# EAGLE schematic MusselBedHeater_RevG (EAGLE 9.6.1)
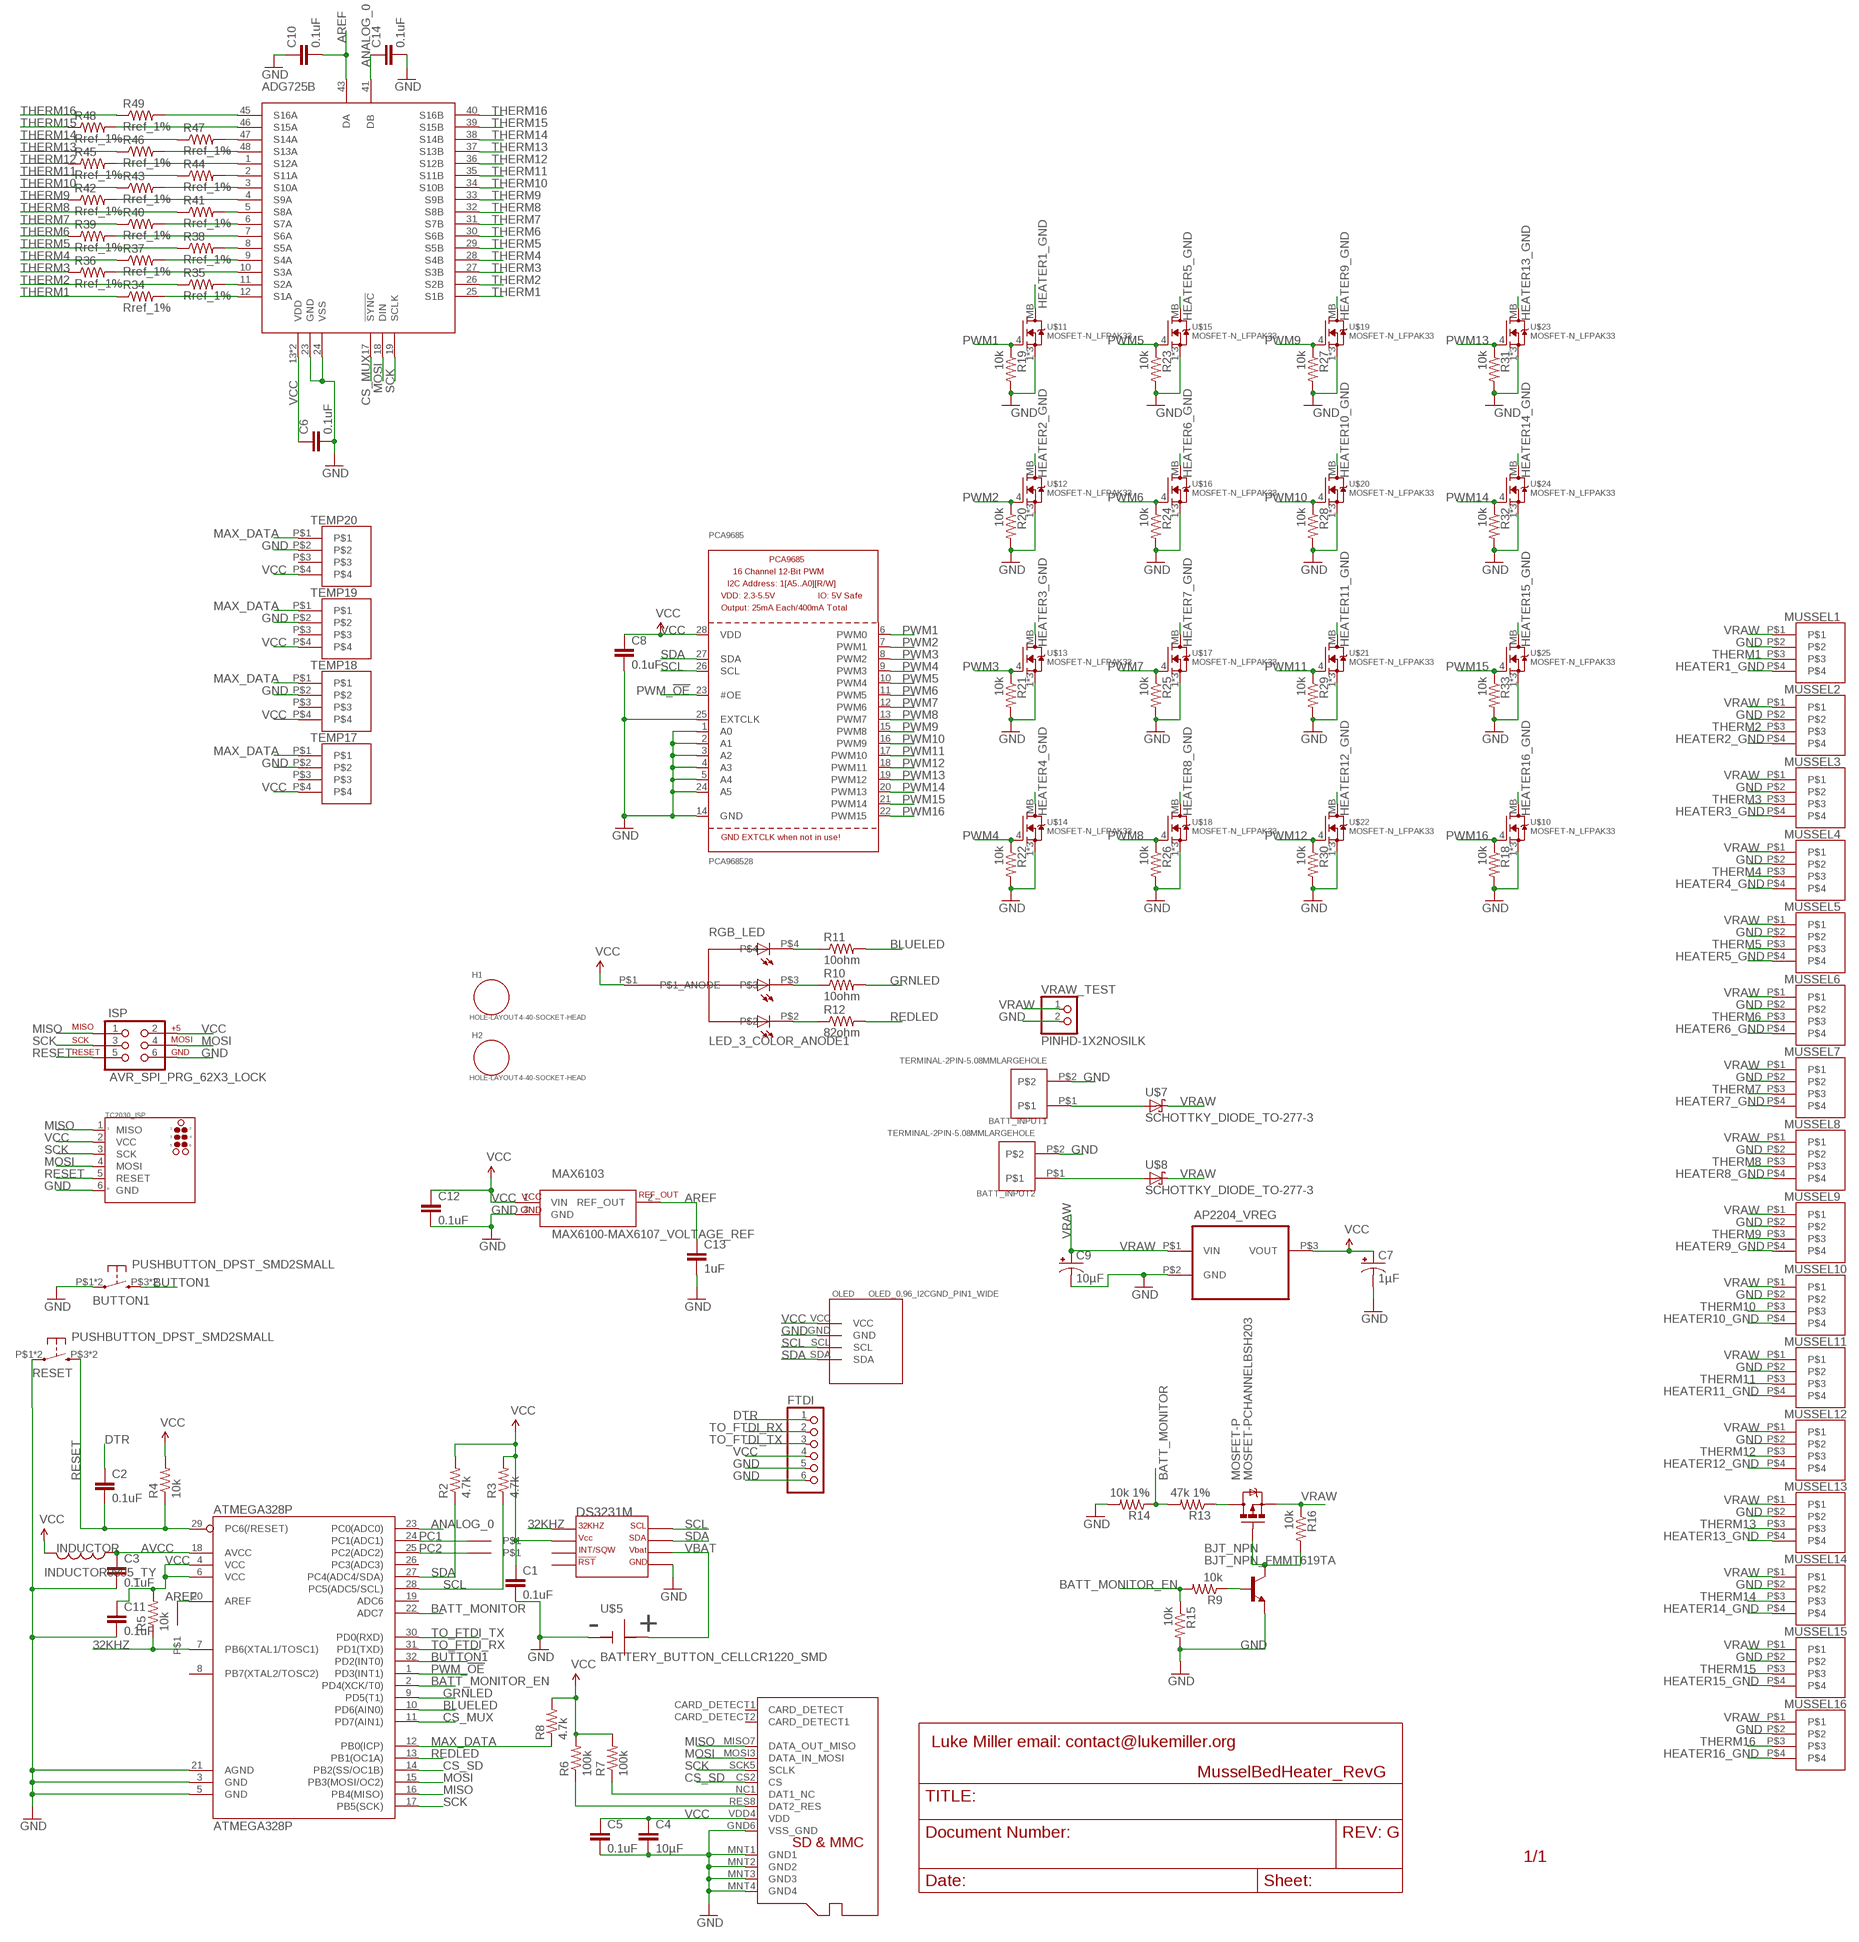
[diagram p0: schematic, sheet 1]

## Parts
ADG725B  ADG725_MUX  [TQFP48]
AP2204_VREG  AP2204R  [SOT-89]
AREF  PINHD-1X1STANDARD  [1X01]
ATMEGA328P  ATMEGA328P  ATMEGA328_SMT  [TQFP32-08]
BATT_INPUT1  TERMINAL-2PIN-5.08MMLARGEHOLE  [TERMINAL-2PIN-5.08MM_LARGEHOLE]
BATT_INPUT2  TERMINAL-2PIN-5.08MMLARGEHOLE  [TERMINAL-2PIN-5.08MM_LARGEHOLE]
BJT_NPN  BJT_NPN_FMMT619TA  [SOT23]
BUTTON1  PUSHBUTTON_DPST_SMD2SMALL  [PUSHBUTTON_SPST_PTS525_SERIES]
C1  0.1uF  CAP0603  [0603]
C2  0.1uF  CAP0603  [0603]
C3  0.1uF  CAP0603  [0603]
C4  10µF  CAP0603  [0603]
C5  0.1uF  CAP0603  [0603]
C6  0.1uF  CAP0603  [0603]
C7  1µF  CPOL-USB  [PANASONIC_B]
C8  0.1uF  CAP0603  [0603]
C9  10µF  CPOL-USC  [PANASONIC_C]
C10  0.1uF  CAP0603  [0603]
C11  0.1uF  CAP0603  [0603]
C12  0.1uF  CAP0603  [0603]
C13  1uF  CAP0603  [0603]
C14  0.1uF  CAP0603  [0603]
DS3231M  DS3231MSOIC-8  [DS3231M_SOIC8]
FTDI  PINHD-1X6RA  [1X06-RIGHT_ANGLE]
H1  HOLE-LAYOUT4-40-SOCKET-HEAD  [4-40-SCREW-HOLE]
H2  HOLE-LAYOUT4-40-SOCKET-HEAD  [4-40-SCREW-HOLE]
INDUCTOR  INDUCTOR0805_TY  [I_0805]
ISP  AVR_SPI_PRG_62X3_LOCK  [2X3_LOCK]
MAX6103  MAX6100-MAX6107_VOLTAGE_REF  [SOT23-3]
MOSFET-P  MOSFET-PCHANNELBSH203  [SOT23-3]
MUSSEL1  MOLEX_KK_254_4_PIN_HEADER  [MOLEX_KK_254_4PIN_HEADER]
MUSSEL2  MOLEX_KK_254_4_PIN_HEADER  [MOLEX_KK_254_4PIN_HEADER]
MUSSEL3  MOLEX_KK_254_4_PIN_HEADER  [MOLEX_KK_254_4PIN_HEADER]
MUSSEL4  MOLEX_KK_254_4_PIN_HEADER  [MOLEX_KK_254_4PIN_HEADER]
MUSSEL5  MOLEX_KK_254_4_PIN_HEADER  [MOLEX_KK_254_4PIN_HEADER]
MUSSEL6  MOLEX_KK_254_4_PIN_HEADER  [MOLEX_KK_254_4PIN_HEADER]
MUSSEL7  MOLEX_KK_254_4_PIN_HEADER  [MOLEX_KK_254_4PIN_HEADER]
MUSSEL8  MOLEX_KK_254_4_PIN_HEADER  [MOLEX_KK_254_4PIN_HEADER]
MUSSEL9  MOLEX_KK_254_4_PIN_HEADER  [MOLEX_KK_254_4PIN_HEADER]
MUSSEL10  MOLEX_KK_254_4_PIN_HEADER  [MOLEX_KK_254_4PIN_HEADER]
MUSSEL11  MOLEX_KK_254_4_PIN_HEADER  [MOLEX_KK_254_4PIN_HEADER]
MUSSEL12  MOLEX_KK_254_4_PIN_HEADER  [MOLEX_KK_254_4PIN_HEADER]
MUSSEL13  MOLEX_KK_254_4_PIN_HEADER  [MOLEX_KK_254_4PIN_HEADER]
MUSSEL14  MOLEX_KK_254_4_PIN_HEADER  [MOLEX_KK_254_4PIN_HEADER]
MUSSEL15  MOLEX_KK_254_4_PIN_HEADER  [MOLEX_KK_254_4PIN_HEADER]
MUSSEL16  MOLEX_KK_254_4_PIN_HEADER  [MOLEX_KK_254_4PIN_HEADER]
OLED  OLED_0.96_I2CGND_PIN1_WIDE  [OLED_0.96_I2C_GND_PIN1_WIDE]
PC1  PINHD-1X1STANDARD  [1X01]
PC2  PINHD-1X1STANDARD  [1X01]
PCA9685  PCA968528  [28-TSSOP]
R2  4.7k  RESISTOR_SMDR0603  [R0603]
R3  4.7k  RESISTOR_SMDR0603  [R0603]
R4  10k  RESISTOR_SMDR0603  [R0603]
R5  10k  RESISTOR_SMDR0603  [R0603]
R6  100k  RESISTOR_SMDR0603  [R0603]
R7  100k  RESISTOR_SMDR0603  [R0603]
R8  4.7k  RESISTOR_SMDR0603  [R0603]
R9  10k  RESISTOR_SMDR0603  [R0603]
R10  10ohm  RESISTOR_SMDR0603  [R0603]
R11  10ohm  RESISTOR_SMDR0603  [R0603]
R12  82ohm  RESISTOR_SMDR0603  [R0603]
R13  47k 1%  RESISTOR_SMDR0603  [R0603]
R14  10k 1%  RESISTOR_SMDR0603  [R0603]
R15  10k  RESISTOR_SMDR0603  [R0603]
R16  10k  RESISTOR_SMDR0603  [R0603]
R18  10k  RESISTOR_SMDR0603  [R0603]
R19  10k  RESISTOR_SMDR0603  [R0603]
R20  10k  RESISTOR_SMDR0603  [R0603]
R21  10k  RESISTOR_SMDR0603  [R0603]
R22  10k  RESISTOR_SMDR0603  [R0603]
R23  10k  RESISTOR_SMDR0603  [R0603]
R24  10k  RESISTOR_SMDR0603  [R0603]
R25  10k  RESISTOR_SMDR0603  [R0603]
R26  10k  RESISTOR_SMDR0603  [R0603]
R27  10k  RESISTOR_SMDR0603  [R0603]
R28  10k  RESISTOR_SMDR0603  [R0603]
R29  10k  RESISTOR_SMDR0603  [R0603]
R30  10k  RESISTOR_SMDR0603  [R0603]
R31  10k  RESISTOR_SMDR0603  [R0603]
R32  10k  RESISTOR_SMDR0603  [R0603]
R33  10k  RESISTOR_SMDR0603  [R0603]
R34  Rref_1%  RESISTOR_SMDR0603  [R0603]
R35  Rref_1%  RESISTOR_SMDR0603  [R0603]
R36  Rref_1%  RESISTOR_SMDR0603  [R0603]
R37  Rref_1%  RESISTOR_SMDR0603  [R0603]
R38  Rref_1%  RESISTOR_SMDR0603  [R0603]
R39  Rref_1%  RESISTOR_SMDR0603  [R0603]
R40  Rref_1%  RESISTOR_SMDR0603  [R0603]
R41  Rref_1%  RESISTOR_SMDR0603  [R0603]
R42  Rref_1%  RESISTOR_SMDR0603  [R0603]
R43  Rref_1%  RESISTOR_SMDR0603  [R0603]
R44  Rref_1%  RESISTOR_SMDR0603  [R0603]
R45  Rref_1%  RESISTOR_SMDR0603  [R0603]
R46  Rref_1%  RESISTOR_SMDR0603  [R0603]
R47  Rref_1%  RESISTOR_SMDR0603  [R0603]
R48  Rref_1%  RESISTOR_SMDR0603  [R0603]
R49  Rref_1%  RESISTOR_SMDR0603  [R0603]
RESET  PUSHBUTTON_DPST_SMD2SMALL  [PUSHBUTTON_SPST_PTS525_SERIES]
RGB_LED  LED_3_COLOR_ANODE1  [LED_RGB_SMD_1.6X1.6]
TC2030_ISP  TC2030-MCP-NL  [TC2030-MCP-NL]
TEMP17  MOLEX_KK_254_4_PIN_HEADER  [MOLEX_KK_254_4PIN_HEADER]
TEMP18  MOLEX_KK_254_4_PIN_HEADER  [MOLEX_KK_254_4PIN_HEADER]
TEMP19  MOLEX_KK_254_4_PIN_HEADER  [MOLEX_KK_254_4PIN_HEADER]
TEMP20  MOLEX_KK_254_4_PIN_HEADER  [MOLEX_KK_254_4PIN_HEADER]
U$2  MICROSD_MOLEX_REVERSECURRENT  [MICROSD_SOCKET_MOLEX_REVERSEMOUNT]
U$5  BATTERY_BUTTON_CELLCR1220_SMD  [CR1220_BATTERY_HOLDER_SMD]
U$7  SCHOTTKY_DIODE_TO-277-3  [TO-277-3]
U$8  SCHOTTKY_DIODE_TO-277-3  [TO-277-3]
U$10  MOSFET-N_LFPAK33  [SOT1210]
U$11  MOSFET-N_LFPAK33  [SOT1210]
U$12  MOSFET-N_LFPAK33  [SOT1210]
U$13  MOSFET-N_LFPAK33  [SOT1210]
U$14  MOSFET-N_LFPAK33  [SOT1210]
U$15  MOSFET-N_LFPAK33  [SOT1210]
U$16  MOSFET-N_LFPAK33  [SOT1210]
U$17  MOSFET-N_LFPAK33  [SOT1210]
U$18  MOSFET-N_LFPAK33  [SOT1210]
U$19  MOSFET-N_LFPAK33  [SOT1210]
U$20  MOSFET-N_LFPAK33  [SOT1210]
U$21  MOSFET-N_LFPAK33  [SOT1210]
U$22  MOSFET-N_LFPAK33  [SOT1210]
U$23  MOSFET-N_LFPAK33  [SOT1210]
U$24  MOSFET-N_LFPAK33  [SOT1210]
U$25  MOSFET-N_LFPAK33  [SOT1210]
VRAW_TEST  PINHD-1X2NOSILK  [1X02_NOSILK]

## Nets
32KHZ: ATMEGA328P.7(PB6(XTAL1/TOSC1)) DS3231M.1(P$1_32KHZ) R5.1
ANALOG_0: ADG725B.41(DB) ATMEGA328P.23(PC0(ADC0)) C14.1
AREF: ADG725B.43(DA) AREF.1 ATMEGA328P.20(AREF) C10.2 C13.1 MAX6103.2(REF_OUT)
AVCC: ATMEGA328P.18(AVCC) C3.1 INDUCTOR.P$1
BATT_MONITOR: ATMEGA328P.22(ADC7) R13.2 R14.1
BATT_MONITOR_EN: ATMEGA328P.2(PD4(XCK/T0)) R9.2 R15.1
BLUELED: ATMEGA328P.10(PD6(AIN0)) R11.2
BUTTON1: ATMEGA328P.32(PD2(INT0)) BUTTON1.P$3(S) BUTTON1.P$4(S)
CS_MUX: ADG725B.17(!SYNC) ATMEGA328P.11(PD7(AIN1))
CS_SD: ATMEGA328P.14(PB2(SS/OC1B)) U$2.CS2(CS)
DTR: C2.1 FTDI.1
GND: ADG725B.23(GND) ADG725B.24(VSS) AP2204_VREG.P$2(GND) ATMEGA328P.3(GND) ATMEGA328P.5(GND) ATMEGA328P.21(AGND) BATT_INPUT1.P$2 BATT_INPUT2.P$2 BJT_NPN.2(E) BUTTON1.P$1(P) BUTTON1.P$2(P) C1.2 C3.2 C4.2 C5.2 C6.2 C7.- C8.2 C9.- C10.1 C11.2 C12.2 C13.2 C14.2 DS3231M.5(P$5_GND) FTDI.5 FTDI.6 ISP.6 MAX6103.3(GND) MUSSEL1.P$2 MUSSEL2.P$2 MUSSEL3.P$2 MUSSEL4.P$2 MUSSEL5.P$2 MUSSEL6.P$2 MUSSEL7.P$2 MUSSEL8.P$2 MUSSEL9.P$2 MUSSEL10.P$2 MUSSEL11.P$2 MUSSEL12.P$2 MUSSEL13.P$2 MUSSEL14.P$2 MUSSEL15.P$2 MUSSEL16.P$2 OLED.GND PCA9685.1(A0) PCA9685.2(A1) PCA9685.3(A2) PCA9685.4(A3) PCA9685.5(A4) PCA9685.14(GND) PCA9685.24(A5) PCA9685.25(EXTCLK) R14.2 R15.2 R18.2 R19.2 R20.2 R21.2 R22.2 R23.2 R24.2 R25.2 R26.2 R27.2 R28.2 R29.2 R30.2 R31.2 R32.2 R33.2 RESET.P$1(P) RESET.P$2(P) TC2030_ISP.6(GND) TEMP17.P$2 TEMP18.P$2 TEMP19.P$2 TEMP20.P$2 U$2.GND6(VSS_GND) U$2.MNT1(GND1) U$2.MNT2(GND2) U$2.MNT3(GND3) U$2.MNT4(GND4) U$5.GND U$10.1(S) U$10.2(S) U$10.3(S) U$11.1(S) U$11.2(S) U$11.3(S) U$12.1(S) U$12.2(S) U$12.3(S) U$13.1(S) U$13.2(S) U$13.3(S) U$14.1(S) U$14.2(S) U$14.3(S) U$15.1(S) U$15.2(S) U$15.3(S) U$16.1(S) U$16.2(S) U$16.3(S) U$17.1(S) U$17.2(S) U$17.3(S) U$18.1(S) U$18.2(S) U$18.3(S) U$19.1(S) U$19.2(S) U$19.3(S) U$20.1(S) U$20.2(S) U$20.3(S) U$21.1(S) U$21.2(S) U$21.3(S) U$22.1(S) U$22.2(S) U$22.3(S) U$23.1(S) U$23.2(S) U$23.3(S) U$24.1(S) U$24.2(S) U$24.3(S) U$25.1(S) U$25.2(S) U$25.3(S) VRAW_TEST.2
GRNLED: ATMEGA328P.9(PD5(T1)) R10.2
HEATER1_GND: MUSSEL1.P$4 U$11.MB(D)
HEATER2_GND: MUSSEL2.P$4 U$12.MB(D)
HEATER3_GND: MUSSEL3.P$4 U$13.MB(D)
HEATER4_GND: MUSSEL4.P$4 U$14.MB(D)
HEATER5_GND: MUSSEL5.P$4 U$15.MB(D)
HEATER6_GND: MUSSEL6.P$4 U$16.MB(D)
HEATER7_GND: MUSSEL7.P$4 U$17.MB(D)
HEATER8_GND: MUSSEL8.P$4 U$18.MB(D)
HEATER9_GND: MUSSEL9.P$4 U$19.MB(D)
HEATER10_GND: MUSSEL10.P$4 U$20.MB(D)
HEATER11_GND: MUSSEL11.P$4 U$21.MB(D)
HEATER12_GND: MUSSEL12.P$4 U$22.MB(D)
HEATER13_GND: MUSSEL13.P$4 U$23.MB(D)
HEATER14_GND: MUSSEL14.P$4 U$24.MB(D)
HEATER15_GND: MUSSEL15.P$4 U$25.MB(D)
HEATER16_GND: MUSSEL16.P$4 U$10.MB(D)
MAX_DATA: ATMEGA328P.12(PB0(ICP)) R8.1 TEMP17.P$1 TEMP18.P$1 TEMP19.P$1 TEMP20.P$1
MISO: ATMEGA328P.16(PB4(MISO)) ISP.1 TC2030_ISP.1(MISO) U$2.MISO7(DATA_OUT_MISO)
MOSI: ADG725B.18(DIN) ATMEGA328P.15(PB3(MOSI/OC2)) ISP.4 TC2030_ISP.4(MOSI) U$2.MOSI3(DATA_IN_MOSI)
N$1: BATT_INPUT1.P$1 U$7.P$1(A) U$7.P$2(A)
N$2: BATT_INPUT2.P$1 U$8.P$1(A) U$8.P$2(A)
N$4: R7.1 U$2.NC1(DAT1_NC)
N$5: R6.1 U$2.RES8(DAT2_RES)
N$6: BJT_NPN.3(C) MOSFET-P.1(G) R16.2
N$7: BJT_NPN.1(B) R9.1
N$8: ADG725B.12(S1A) R34.2
N$9: R12.1 RGB_LED.P$2
N$10: R10.1 RGB_LED.P$3
N$11: R11.1 RGB_LED.P$4
N$13: MOSFET-P.3(D) R13.1
N$28: ADG725B.11(S2A) R35.2
N$30: ADG725B.10(S3A) R36.2
N$32: ADG725B.9(S4A) R37.2
N$34: ADG725B.8(S5A) R38.2
N$36: ADG725B.7(S6A) R39.2
N$38: ADG725B.6(S7A) R40.2
N$40: ADG725B.5(S8A) R41.2
N$42: ADG725B.4(S9A) R42.2
N$44: ADG725B.3(S10A) R43.2
N$46: ADG725B.2(S11A) R44.2
N$48: ADG725B.1(S12A) R45.2
N$50: ADG725B.48(S13A) R46.2
N$52: ADG725B.47(S14A) R47.2
N$54: ADG725B.46(S15A) R48.2
N$56: ADG725B.45(S16A) R49.2
PC1: ATMEGA328P.24(PC1(ADC1)) PC1.1
PC2: ATMEGA328P.25(PC2(ADC2)) PC2.1
PWM1: PCA9685.6(PWM0) R19.1 U$11.4(G)
PWM2: PCA9685.7(PWM1) R20.1 U$12.4(G)
PWM3: PCA9685.8(PWM2) R21.1 U$13.4(G)
PWM4: PCA9685.9(PWM3) R22.1 U$14.4(G)
PWM5: PCA9685.10(PWM4) R23.1 U$15.4(G)
PWM6: PCA9685.11(PWM5) R24.1 U$16.4(G)
PWM7: PCA9685.12(PWM6) R25.1 U$17.4(G)
PWM8: PCA9685.13(PWM7) R26.1 U$18.4(G)
PWM9: PCA9685.15(PWM8) R27.1 U$19.4(G)
PWM10: PCA9685.16(PWM9) R28.1 U$20.4(G)
PWM11: PCA9685.17(PWM10) R29.1 U$21.4(G)
PWM12: PCA9685.18(PWM11) R30.1 U$22.4(G)
PWM13: PCA9685.19(PWM12) R31.1 U$23.4(G)
PWM14: PCA9685.20(PWM13) R32.1 U$24.4(G)
PWM15: PCA9685.21(PWM14) R33.1 U$25.4(G)
PWM16: PCA9685.22(PWM15) R18.1 U$10.4(G)
PWM_!OE: ATMEGA328P.1(PD3(INT1)) PCA9685.23(#OE)
REDLED: ATMEGA328P.13(PB1(OC1A)) R12.2
RESET: ATMEGA328P.29(PC6(/RESET)) C2.2 ISP.5 R4.1 RESET.P$3(S) RESET.P$4(S) TC2030_ISP.5(RESET)
SCK: ADG725B.19(SCLK) ATMEGA328P.17(PB5(SCK)) ISP.3 TC2030_ISP.3(SCK) U$2.SCK5(SCLK)
SCL: ATMEGA328P.28(PC5(ADC5/SCL)) DS3231M.8(P$8_SCL) OLED.SCL PCA9685.26(SCL) R3.1
SDA: ATMEGA328P.27(PC4(ADC4/SDA)) DS3231M.7(P$7_SDA) OLED.SDA PCA9685.27(SDA) R2.1
THERM1: ADG725B.25(S1B) MUSSEL1.P$3 R34.1
THERM2: ADG725B.26(S2B) MUSSEL2.P$3 R35.1
THERM3: ADG725B.27(S3B) MUSSEL3.P$3 R36.1
THERM4: ADG725B.28(S4B) MUSSEL4.P$3 R37.1
THERM5: ADG725B.29(S5B) MUSSEL5.P$3 R38.1
THERM6: ADG725B.30(S6B) MUSSEL6.P$3 R39.1
THERM7: ADG725B.31(S7B) MUSSEL7.P$3 R40.1
THERM8: ADG725B.32(S8B) MUSSEL8.P$3 R41.1
THERM9: ADG725B.33(S9B) MUSSEL9.P$3 R42.1
THERM10: ADG725B.34(S10B) MUSSEL10.P$3 R43.1
THERM11: ADG725B.35(S11B) MUSSEL11.P$3 R44.1
THERM12: ADG725B.36(S12B) MUSSEL12.P$3 R45.1
THERM13: ADG725B.37(S13B) MUSSEL13.P$3 R46.1
THERM14: ADG725B.38(S14B) MUSSEL14.P$3 R47.1
THERM15: ADG725B.39(S15B) MUSSEL15.P$3 R48.1
THERM16: ADG725B.40(S16B) MUSSEL16.P$3 R49.1
TO_FTDI_RX: ATMEGA328P.31(PD1(TXD)) FTDI.2
TO_FTDI_TX: ATMEGA328P.30(PD0(RXD)) FTDI.3
VBAT: DS3231M.6(P$6_VBAT) U$5.P$1(VBAT) U$5.P$2(VBAT)
VCC: ADG725B.13(VDD) ADG725B.14(VDD) AP2204_VREG.P$3(VOUT) ATMEGA328P.4(VCC) ATMEGA328P.6(VCC) C1.1 C4.1 C5.1 C6.1 C7.+ C8.1 C11.1 C12.1 DS3231M.2(P$2_VCC) FTDI.4 INDUCTOR.P$2 ISP.2 MAX6103.1(VIN) OLED.VCC PCA9685.28(VDD) R2.2 R3.2 R4.2 R5.2 R6.2 R7.2 R8.2 RGB_LED.P$1(P$1_ANODE) TC2030_ISP.2(VCC) TEMP17.P$4 TEMP18.P$4 TEMP19.P$4 TEMP20.P$4 U$2.VDD4(VDD)
VRAW: AP2204_VREG.P$1(VIN) C9.+ MOSFET-P.2(S) MUSSEL1.P$1 MUSSEL2.P$1 MUSSEL3.P$1 MUSSEL4.P$1 MUSSEL5.P$1 MUSSEL6.P$1 MUSSEL7.P$1 MUSSEL8.P$1 MUSSEL9.P$1 MUSSEL10.P$1 MUSSEL11.P$1 MUSSEL12.P$1 MUSSEL13.P$1 MUSSEL14.P$1 MUSSEL15.P$1 MUSSEL16.P$1 R16.1 U$7.P$3(C) U$8.P$3(C) VRAW_TEST.1
Unconnected: ATMEGA328P.8(PB7(XTAL2/TOSC2)) ATMEGA328P.19(ADC6) ATMEGA328P.26(PC3(ADC3)) DS3231M.3(P$3_INT) DS3231M.4(P$4_RST) TEMP17.P$3 TEMP18.P$3 TEMP19.P$3 TEMP20.P$3 U$2.CARD_DETECT1(CARD_DETECT) U$2.CARD_DETECT2(CARD_DETECT1)

## Library data of the parts
ADG725B = miller:ADG725_MUX: Analog Devices ADG725 dual-channel 16:1 multiplexer/demultiplexer In single supply mode, tie pin Vss to GND.
AP2204_VREG = miller:AP2204: Voltage regulator AP2204 Diodes Incorporated NOTE versions R, RA, RB all differ in their pinouts.
AREF PC1 PC2 = miller:PINHD-1X1: Just a single pin header, useful for making test point or stand-alone header hole for normal 0.1" pitch through-hole header pins The SMALL footprint is 0.035" diameter, barely large enough for standard 0.1" pitch header pins. The SMALL_0.7 footprint is 1.056mm diameter, drill hole is 0.7mm, too small for 0.1" pitch header pins
ATMEGA328P = miller:ATMEGA328_SMT: 32-Pin Atmega328
BATT_INPUT1 BATT_INPUT2 = miller:TERMINAL-2PIN-5.08MM: 2-pin terminal block
BJT_NPN = miller:BJT_NPN_FMMT619TA: BJT NPN Transistor Diodes Incorporated FMMT619 SOT23 package
BUTTON1 RESET = miller:PUSHBUTTON_DPST_SMD2: PUSHBUTTON DPST SMD Standard Omron B3S-1000 Digikey PN SW836CT-ND This is your standard "hobbyist" style momentary pushbutton in a surface mount package. Small C&K PTS525 series tactile switch - This is a smaller, low-profile pushbutton, which is has a smaller footprint, smaller button, and would be harder to accidentally trigger (button height above board = 1.5mm) (Digikey PN CKN9104CT-ND)
C1-C6 C8 C10-C14 = miller:CAP: Capacitor Standard surface mount ceramic capacitor and 0.1" leaded capacitor.
C7 C9 = miller:CPOL-US: POLARIZED CAPACITOR, American symbol
DS3231M = miller:DS3231M: DS3231M real time clock Battery backup, 2.3V to 5.5V supply voltage 1Hz and 32.768kHz outputs NOTE: This is a slightly lower cost version of the regular DS3231S, with fewer clock frequency output options and slightly lower long-term time accuracy. It uses the same I2C communications protocol as the DS3231S, and is available in a small SOIC-8 package or Wide SOIC-16 (0.300") package. Maxim PN DS3231MZ+ SOIC-8 package Maxim PN DS3231M+ SOIC-16 Wide package
FTDI = miller:PINHD-1X6: PIN HEADER
H1 H2 = miller:HOLE-LAYOUT: Drill hole
INDUCTOR = miller:INDUCTOR: Inductor Example: Taiyo Yuden PN LBR2012T100K
ISP = miller:AVR_SPI_PRG_6: AVR ISP 6 Pin This is the reduced ISP connector for AVR programming. Common on Arduino. This footprint will take up less PCB space and can be used with a 10-pin to 6-pin adapter such as SKU: BOB-08508 **Special note about "TEST_POINT" package. The stop mask is on the top side, so if you want your programming test points to be on the bottom of your board, make sure to place this package on the bottom side of the board. This also ensure that the orientation to program from the bottom side will be correct.
MAX6103 = miller:MAX6100-MAX6107_VOLTAGE_REF: MAXIM MAX6100-6107 precision voltage reference
MOSFET-P = miller:MOSFET-PCHANNEL: Generic PMOSFET IRLML2244 - TRANS-11153 (SOT-23 -20V -4.3A) (1.Gate 2.Source 3.Drain) FQP27P06 - COM-10349 <http://www.sparkfun.com/products/10349> (TO-220 -60V -27A) (1.Gate 2.Source 3.Drain) BSH203,215 P-Channel (SOT-23) (-30V, -0.47A); PROD_ID: TRANS-08285
MUSSEL1-MUSSEL16 TEMP17-TEMP20 = miller:MOLEX_KK_254_4_PIN_HEADER: MOLEX KK 254 series PCB header. 0.1" spacing Molex PN# 47053-1000
OLED = miller:OLED_0.96_I2C: CHECK VCC & GND PIN VARIANT OLED 128x64 0.96" I2C module Generic 4-pin I2C OLED module from ebay/amazon etc. SSD1306 driver
PCA9685 = miller:PCA9685: PCA9685 12-bit 16-channel PWM LED driver NXP Semiconductors I2C communication
R2-R16 R18-R49 = miller:RESISTOR_SMD: RESISTOR, American symbol
RGB_LED = miller:LED_3_COLOR_ANODE1: RGB LED with common anode on pin1 Example: Kingbright APTF1616SEEZGKQBKC
TC2030_ISP = miller:TC2030: TAG-CONNECT ICSP Connector Manufacturer: Tag-Connect <http://www.tag-connect.com> Cable for easy In-Circuit Serial Programming. Designed for Microchip ICD2, suitable for many others. Two variants - one "with legs" (for hands-free fit on PCB) and another "without legs" for quick programming. Pin labels changed to match AVR ICSP pinout for programming ATMEL AVR chips PAD Description 1 MCLR/Vpp 2 Vdd 3 GND 4 PGD (ISPDAT) 5 PGC (ISPCLK) 6 nc (used for LVP) ©2009 ROFA.cz - modified and updated by Robert Darlington ‹rdarlington@gmail.com›
U$2 = miller:MICROSD_MOLEX_REVERSE: Molex micro SD connector, push-push spring loaded, "reverse" mount Pins accessible at rear of case. Active: Molex PN 5027740891 Digikey PN WM24066CT-ND Obsolete: Molex PN 49225-201
U$5 = miller:BATTERY_BUTTON_CELL: Coin cell battery holders Check that you choose the appropriate battery size CR1025 (10 mm) CR1220 (12 mm)
U$7 U$8 = miller:SCHOTTKY_DIODE: Schottky diode Example Vishay SS12-E3/61T, Digikey PN SS12-E3/61TGICT-ND High voltage version TO-277-3 footprint - On Semiconductor FSV1060V Note: FSV1060V pads 1&2 connect internally
U$10-U$25 = miller:MOSFET-N_LFPAK33: Nexperia N-channel MOSFET LFPAK33 (SOT1210) package Drain pin is connected to the large mounting base (pin 5) Source is connected to pins 1, 2, 3 Gate is connected to pin 4 Nexperia PN PSMN9R8-30MLC (Digikey PN 1727-7146-1-ND)
VRAW_TEST = miller:PINHD-1X2: 1x2 pin header 0.1" spacing (2.54mm)